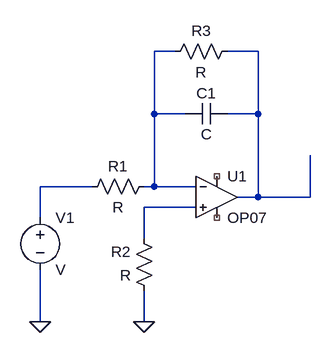
[diagram p0: schematic integrator.asc]
integrator.asc, the LTspice schematic file:
Version 4
SHEET 1 880 680
WIRE 128 -16 96 -16
WIRE 256 -16 208 -16
WIRE 96 80 96 -16
WIRE 144 80 96 80
WIRE 256 80 256 -16
WIRE 256 80 208 80
WIRE 0 192 -80 192
WIRE 96 192 96 80
WIRE 96 192 80 192
WIRE 160 192 96 192
WIRE 256 208 256 80
WIRE 256 208 224 208
WIRE 336 208 336 144
WIRE 336 208 256 208
WIRE 160 224 80 224
WIRE -80 240 -80 192
WIRE 80 272 80 224
WIRE -80 400 -80 320
WIRE 80 400 80 352
FLAG -80 400 0
FLAG 80 400 0
SYMBOL OpAmps\\OP07 192 144 R0
SYMATTR InstName U1
SYMBOL res 96 176 R90
WINDOW 0 0 56 VBottom 2
WINDOW 3 32 56 VTop 2
SYMATTR InstName R1
SYMBOL res 96 368 R180
WINDOW 0 36 76 Left 2
WINDOW 3 36 40 Left 2
SYMATTR InstName R2
SYMBOL voltage -80 224 R0
SYMATTR InstName V1
SYMBOL cap 208 64 R90
WINDOW 0 0 32 VBottom 2
WINDOW 3 32 32 VTop 2
SYMATTR InstName C1
SYMBOL res 224 -32 R90
WINDOW 0 0 56 VBottom 2
WINDOW 3 32 56 VTop 2
SYMATTR InstName R3

The netlist it stands for:
* integrator.asc
XU1 N004 N001 NC_01 NC_02 N002 LT1001  ; OP07, pins In+ In- V+ V- OUT
R1 N001 N003 R
R2 0 N004 R
V1 N003 0 V
C1 N002 N001 C
R3 N002 N001 R
.lib LTC.lib
.backanno
.end